# Altium schematic sheet controller.SchDoc
size A
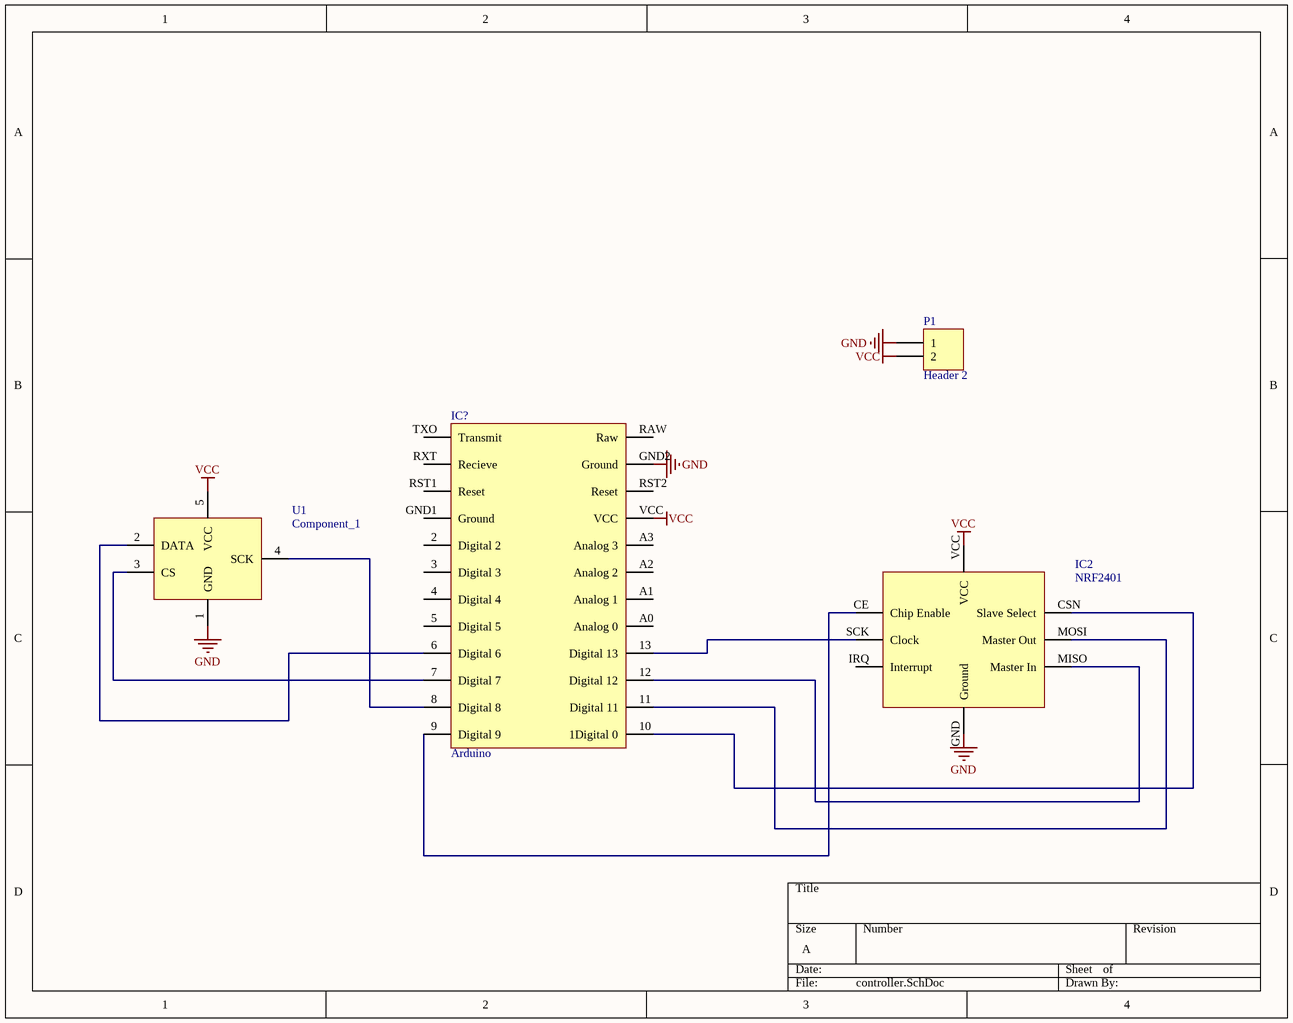
[diagram p0: controller.SchDoc]

## Parts
IC2  NRF2401  [nrf2401]
IC?  Arduino  [Arduino Pro Mini]
P1  Header 2  [HDR1X2]
U1  Component_1  [snescontroller]

## Nets
GND: IC2.GND(Ground) IC?.GND2(Ground) P1.1 U1.1(GND)
VCC: IC2.VCC IC?.VCC P1.2 U1.5(VCC)
NetIC2_CE: IC2.CE(Chip_Enable) IC?.9(Digital_9)
NetIC2_CSN: IC2.CSN(Slave_Select) IC?.10(1Digital_0)
NetIC2_MISO: IC2.MISO(Master_In) IC?.12(Digital_12)
NetIC2_MOSI: IC2.MOSI(Master_Out) IC?.11(Digital_11)
NetIC2_SCK: IC2.SCK(Clock) IC?.13(Digital_13)
NetIC?_6: IC?.6(Digital_6) U1.2(DATA)
NetIC?_7: IC?.7(Digital_7) U1.3(CS)
NetIC?_8: IC?.8(Digital_8) U1.4(SCK)

Not connected (* = marked no-connect by the designer): IC2 IRQ(Interrupt); IC? 2(Digital_2) 3(Digital_3) 4(Digital_4) 5(Digital_5) A0(Analog_0) A1(Analog_1) A2(Analog_2) A3(Analog_3) GND1(Ground) RAW(Raw) RST1(Reset) RST2(Reset) RXT(Recieve) TXO(Transmit)

## Library data of the parts
IC2 = NRF2401: Nrf2401 Wireless Transceiver
IC? = Arduino: Arduino Pro Mini
P1 = Header 2: Header, 2-Pin; LatestRevisionDate: 17-Jul-2002; LatestRevisionNote: Re-released for DXP Platform.; Publisher: Altium Limited
U1 = Component_1: snes  controller